# Altium project usbLora4RX.PrjPCB
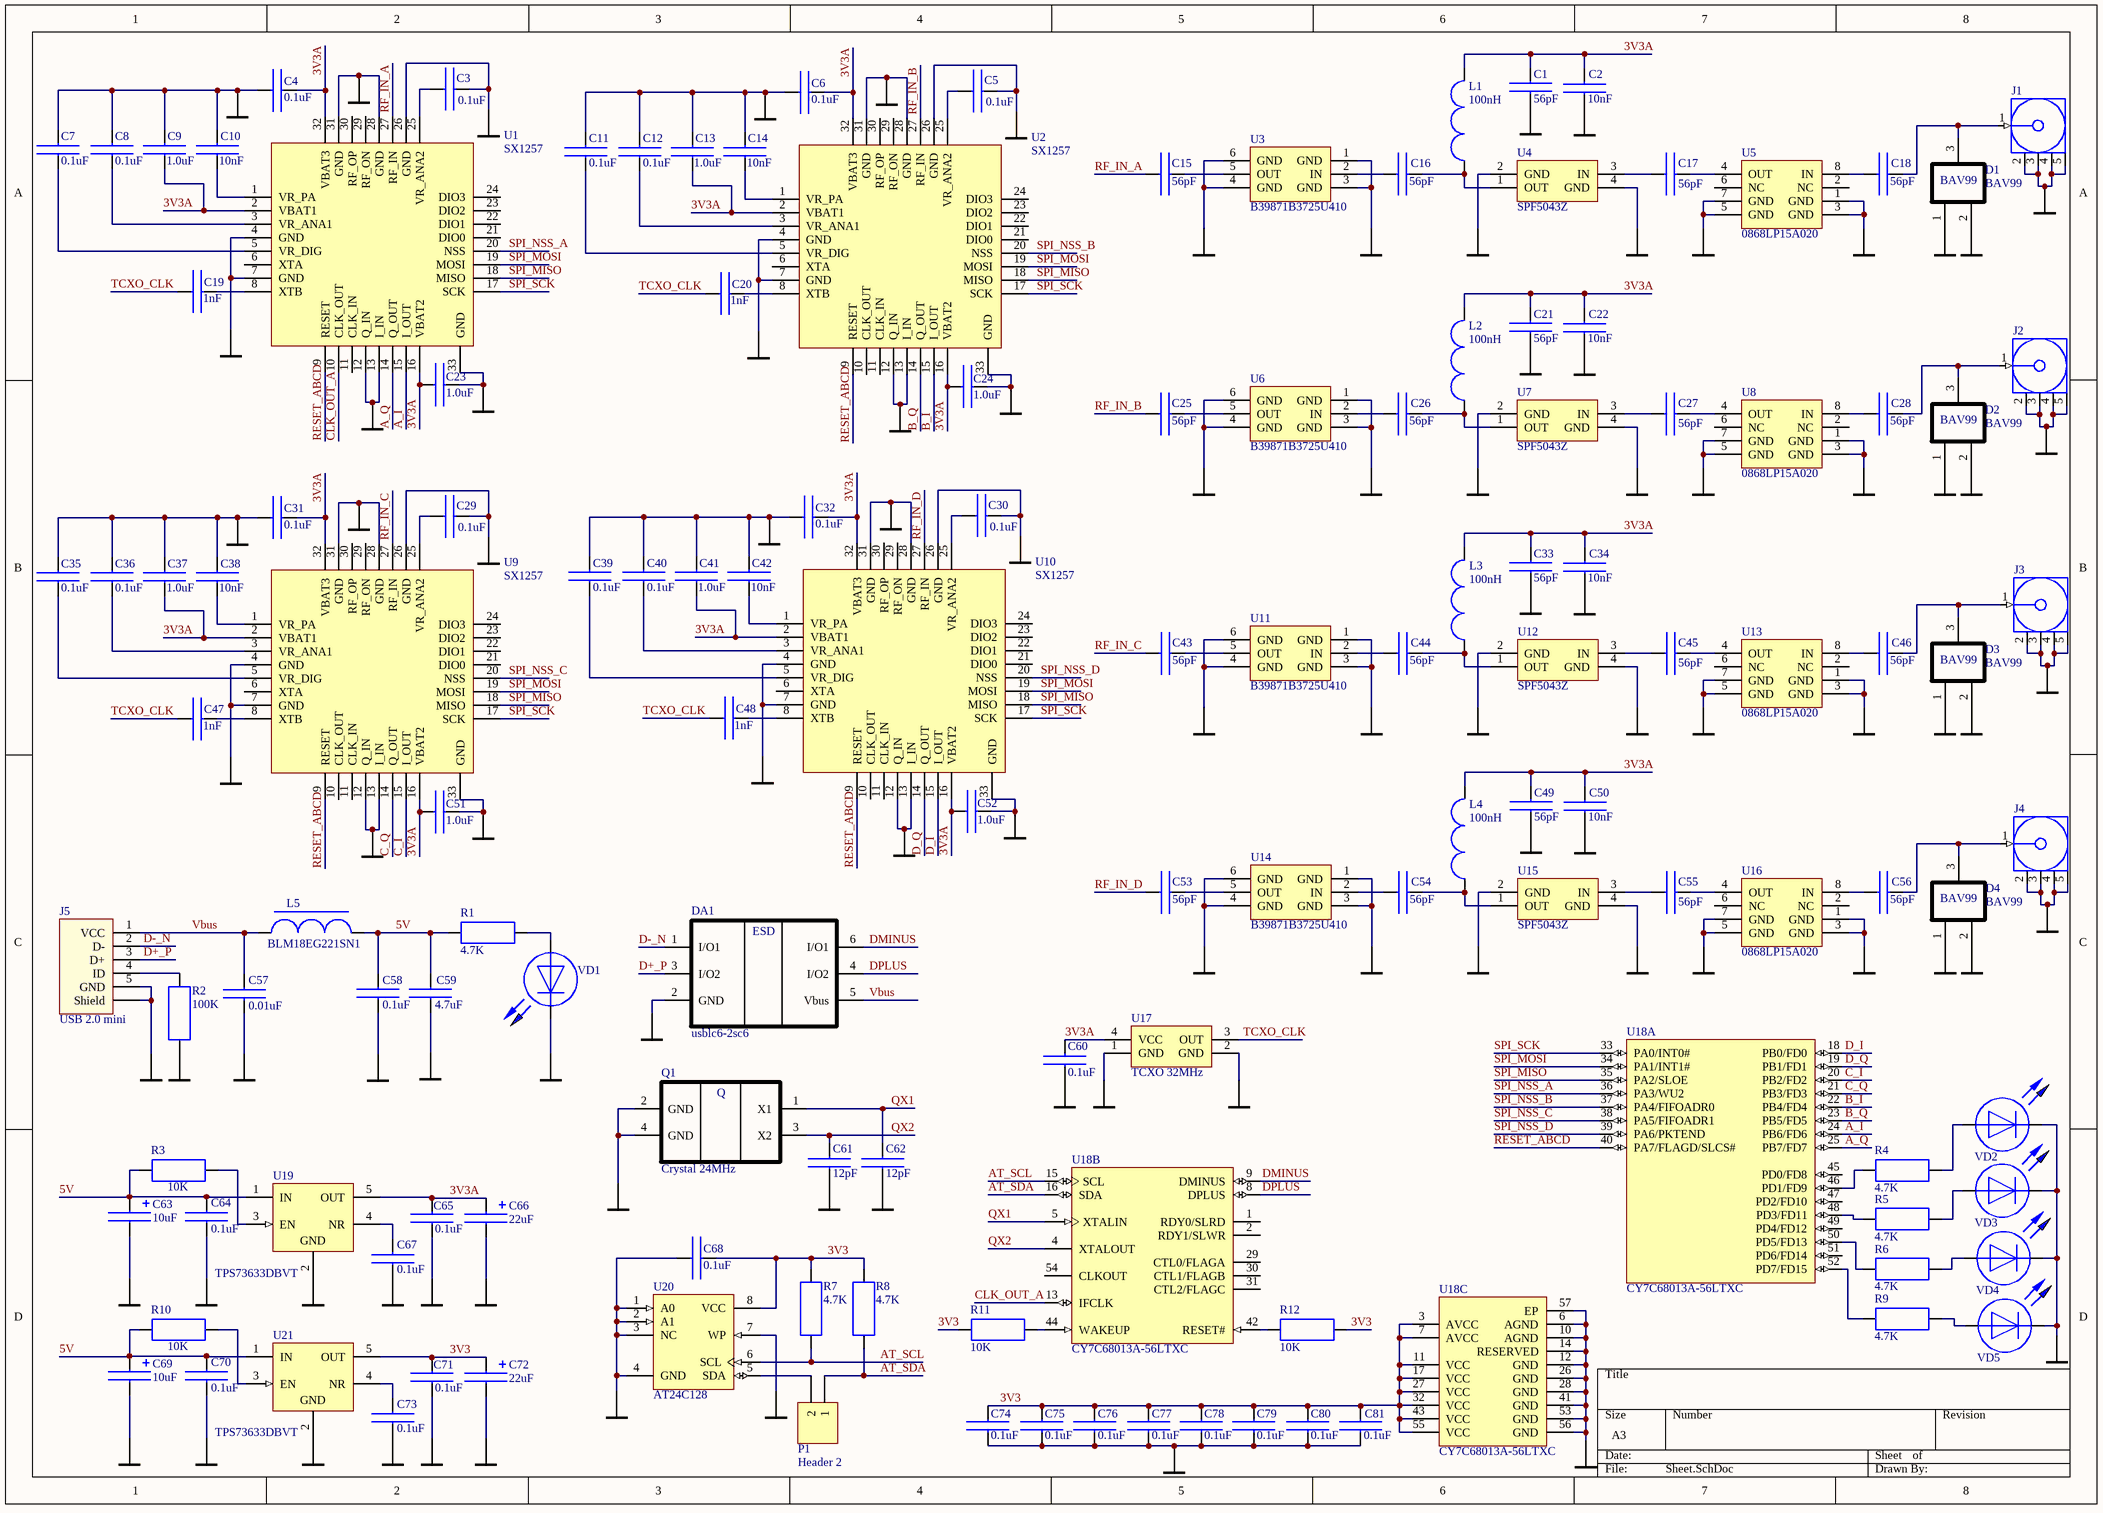
[diagram p0: Sheet.SchDoc]
1 sheet, 136 parts. Net scope: global (net labels, ports and power ports of the same name join across sheets).
Board file: PCB1.PcbDoc

## Sheet Sheet.SchDoc
size A3

### Parts
C1  56pF  [CAP(0603)]
C2  10nF  [CAP(0603)]
C3  0.1uF  [CAP(0603)]
C4  0.1uF  [CAP(0603)]
C5  0.1uF  [CAP(0603)]
C6  0.1uF  [CAP(0603)]
C7  0.1uF  [CAP(0603)]
C8  0.1uF  [CAP(0603)]
C9  1.0uF  [CAP(0603)]
C10  10nF  [CAP(0603)]
C11  0.1uF  [CAP(0603)]
C12  0.1uF  [CAP(0603)]
C13  1.0uF  [CAP(0603)]
C14  10nF  [CAP(0603)]
C15  56pF  [CAP(0603)]
C16  56pF  [CAP(0603)]
C17  56pF  [CAP(0603)]
C18  56pF  [CAP(0603)]
C19  1nF  [CAP(0603)]
C20  1nF  [CAP(0603)]
C21  56pF  [CAP(0603)]
C22  10nF  [CAP(0603)]
C23  1.0uF  [CAP(0603)]
C24  1.0uF  [CAP(0603)]
C25  56pF  [CAP(0603)]
C26  56pF  [CAP(0603)]
C27  56pF  [CAP(0603)]
C28  56pF  [CAP(0603)]
C29  0.1uF  [CAP(0603)]
C30  0.1uF  [CAP(0603)]
C31  0.1uF  [CAP(0603)]
C32  0.1uF  [CAP(0603)]
C33  56pF  [CAP(0603)]
C34  10nF  [CAP(0603)]
C35  0.1uF  [CAP(0603)]
C36  0.1uF  [CAP(0603)]
C37  1.0uF  [CAP(0603)]
C38  10nF  [CAP(0603)]
C39  0.1uF  [CAP(0603)]
C40  0.1uF  [CAP(0603)]
C41  1.0uF  [CAP(0603)]
C42  10nF  [CAP(0603)]
C43  56pF  [CAP(0603)]
C44  56pF  [CAP(0603)]
C45  56pF  [CAP(0603)]
C46  56pF  [CAP(0603)]
C47  1nF  [CAP(0603)]
C48  1nF  [CAP(0603)]
C49  56pF  [CAP(0603)]
C50  10nF  [CAP(0603)]
C51  1.0uF  [CAP(0603)]
C52  1.0uF  [CAP(0603)]
C53  56pF  [CAP(0603)]
C54  56pF  [CAP(0603)]
C55  56pF  [CAP(0603)]
C56  56pF  [CAP(0603)]
C57  0.01uF  [CAP(0603)]
C58  0.1uF  [CAP(0603)]
C59  4.7uF  [CAP(0603)]
C60  0.1uF  [CAP(0603)]
C61  12pF  [CAP(0603)]
C62  12pF  [CAP(0603)]
C63  10uF  [CC3216(1206)x18]
C64  0.1uF  [CAP(0603)]
C65  0.1uF  [CAP(0603)]
C66  22uF  [CC3216(1206)x18]
C67  0.1uF  [CAP(0603)]
C68  0.1uF  [CAP(0603)]
C69  10uF  [CC3216(1206)x18]
C70  0.1uF  [CAP(0603)]
C71  0.1uF  [CAP(0603)]
C72  22uF  [CC3216(1206)x18]
C73  0.1uF  [CAP(0603)]
C74  0.1uF  [CAP(0603)]
C75  0.1uF  [CAP(0603)]
C76  0.1uF  [CAP(0603)]
C77  0.1uF  [CAP(0603)]
C78  0.1uF  [CAP(0603)]
C79  0.1uF  [CAP(0603)]
C80  0.1uF  [CAP(0603)]
C81  0.1uF  [CAP(0603)]
D1  BAV99  [SOT-23B]
D2  BAV99  [SOT-23B]
D3  BAV99  [SOT-23B]
D4  BAV99  [SOT-23B]
DA1  usblc6-2sc6  [SOT23-6L]
J1  60312202114514  [60312202114514]  (value not drawn)
J2  60312202114514  [60312202114514]  (value not drawn)
J3  60312202114514  [60312202114514]  (value not drawn)
J4  60312202114514  [60312202114514]  (value not drawn)
J5  USB 2.0 mini  [65100516121]
L1  100nH  [L_0603]
L2  100nH  [L_0603]
L3  100nH  [L_0603]
L4  100nH  [L_0603]
L5  BLM18EG221SN1  [BLM18EG221SN1]
P1  Header 2  [HDR1X2]
Q1  Crystal 24MHz  [SMD3225]
R1  4.7K  [RES(0603)]
R2  100K  [RES(0603)]
R3  10K  [RES(0603)]
R4  4.7K  [RES(0603)]
R5  4.7K  [RES(0603)]
R6  4.7K  [RES(0603)]
R7  4.7K  [RES(0603)]
R8  4.7K  [RES(0603)]
R9  4.7K  [RES(0603)]
R10  10K  [RES(0603)]
R11  10K  [RES(0603)]
R12  10K  [RES(0603)]
U1  SX1257  [QFN-32]
U2  SX1257  [QFN-32]
U3  B39871B3725U410  [SAW_Filter]
U4  SPF5043Z  [SOT343-4]
U5  0868LP15A020  [LPF868]
U6  B39871B3725U410  [SAW_Filter]
U7  SPF5043Z  [SOT343-4]
U8  0868LP15A020  [LPF868]
U9  SX1257  [QFN-32]
U10  SX1257  [QFN-32]
U11  B39871B3725U410  [SAW_Filter]
U12  SPF5043Z  [SOT343-4]
U13  0868LP15A020  [LPF868]
U14  B39871B3725U410  [SAW_Filter]
U15  SPF5043Z  [SOT343-4]
U16  0868LP15A020  [LPF868]
U17  TCXO 32MHz  [TCXO]
U18  CY7C68013A-56LTXC  [CYP-LTX56-5200X4500TP_N]  (parts A,B,C of 3)
U19  TPS73633DBVT  [TI-DBV5_N]
U20  AT24C128  [8S1_N]
U21  TPS73633DBVT  [TI-DBV5_N]
VD1  VD_6  [LED_0603]  (value not drawn)
VD2  VD_6  [LED_0603]  (value not drawn)
VD3  VD_6  [LED_0603]  (value not drawn)
VD4  VD_6  [LED_0603]  (value not drawn)
VD5  VD_6  [LED_0603]  (value not drawn)

### Nets
GND: C1.1 C2.1 C3.2 C4.1 C5.2 C6.1 C7.2 C8.2 C9.2 C10.2 C11.2 C12.2 C13.2 C14.2 C21.1 C22.1 C23.1 C24.1 C29.2 C30.2 C31.1 C32.1 C33.1 C34.1 C35.2 C36.2 C37.2 C38.2 C39.2 C40.2 C41.2 C42.2 C49.1 C50.1 C51.1 C52.1 C57.1 C58.1 C59.1 C60.1 C61.1 C62.1 C63.2 C64.1 C65.1 C66.2 C67.1 C68.1 C69.2 C70.1 C71.1 C72.2 C73.1 C74.1 C75.1 C76.1 C77.1 C78.1 C79.1 C80.1 C81.1 D1.1 D1.2 D2.1 D2.2 D3.1 D3.2 D4.1 D4.2 DA1.2(GND) J1.2(GND) J1.3(GND) J1.4(GND) J1.5(GND) J2.2(GND) J2.3(GND) J2.4(GND) J2.5(GND) J3.2(GND) J3.3(GND) J3.4(GND) J3.5(GND) J4.2(GND) J4.3(GND) J4.4(GND) J4.5(GND) J5.5(GND) J5.Shell(Shield) Q1.2(GND) Q1.4(GND) R2.1 U1.4(GND) U1.7(GND) U1.12(Q_IN) U1.13(I_IN) U1.26(GND) U1.28(GND) U1.31(GND) U1.33(GND) U2.4(GND) U2.7(GND) U2.12(Q_IN) U2.13(I_IN) U2.26(GND) U2.28(GND) U2.31(GND) U2.33(GND) U3.1(GND) U3.3(GND) U3.4(GND) U3.6(GND) U4.2(GND) U4.4(GND) U5.1(GND) U5.3(GND) U5.5(GND) U5.7(GND) U6.1(GND) U6.3(GND) U6.4(GND) U6.6(GND) U7.2(GND) U7.4(GND) U8.1(GND) U8.3(GND) U8.5(GND) U8.7(GND) U9.4(GND) U9.7(GND) U9.12(Q_IN) U9.13(I_IN) U9.26(GND) U9.28(GND) U9.31(GND) U9.33(GND) U10.4(GND) U10.7(GND) U10.12(Q_IN) U10.13(I_IN) U10.26(GND) U10.28(GND) U10.31(GND) U10.33(GND) U11.1(GND) U11.3(GND) U11.4(GND) U11.6(GND) U12.2(GND) U12.4(GND) U13.1(GND) U13.3(GND) U13.5(GND) U13.7(GND) U14.1(GND) U14.3(GND) U14.4(GND) U14.6(GND) U15.2(GND) U15.4(GND) U16.1(GND) U16.3(GND) U16.5(GND) U16.7(GND) U17.1(GND) U17.2(GND) U18.6(AGND) U18.10(AGND) U18.12(GND) U18.14(RESERVED) U18.26(GND) U18.28(GND) U18.41(GND) U18.53(GND) U18.56(GND) U18.57(EP) U19.2(GND) U20.1(A0) U20.2(A1) U20.3(NC) U20.4(GND) U20.7(WP) U21.2(GND) VD1.K VD2.K VD3.K VD4.K VD5.K
3V3: C68.2 C71.2 C72.1 C74.2 C75.2 C76.2 C77.2 C78.2 C79.2 C80.2 C81.2 R7.2 R8.2 R11.1 R12.2 U18.3(AVCC) U18.7(AVCC) U18.11(VCC) U18.17(VCC) U18.27(VCC) U18.32(VCC) U18.43(VCC) U18.55(VCC) U20.8(VCC) U21.5(OUT)
3V3A: C1.2 C2.2 C4.2 C6.2 C9.1 C13.1 C21.2 C22.2 C23.2 C24.2 C31.2 C32.2 C33.2 C34.2 C37.1 C41.1 C49.2 C50.2 C51.2 C52.2 C60.2 C65.2 C66.1 L1.2 L2.2 L3.2 L4.2 U1.2(VBAT1) U1.16(VBAT2) U1.32(VBAT3) U2.2(VBAT1) U2.16(VBAT2) U2.32(VBAT3) U9.2(VBAT1) U9.16(VBAT2) U9.32(VBAT3) U10.2(VBAT1) U10.16(VBAT2) U10.32(VBAT3) U17.4(VCC) U19.5(OUT)
5V: C58.2 C59.2 C63.1 C64.2 C69.1 C70.2 L5.2 R1.1 R3.1 R10.1 U19.1(IN) U21.1(IN)
A_I: U1.15(I_OUT) U18.24(PB6/FD6)
A_Q: U1.14(Q_OUT) U18.25(PB7/FD7)
AT_SCL: R7.1 U18.15(SCL) U20.6(SCL)
AT_SDA: P1.1 R8.1 U18.16(SDA)
B_I: U2.15(I_OUT) U18.22(PB4/FD4)
B_Q: U2.14(Q_OUT) U18.23(PB5/FD5)
C_I: U9.15(I_OUT) U18.20(PB2/FD2)
C_Q: U9.14(Q_OUT) U18.21(PB3/FD3)
CLK_OUT_A: U1.10(CLK_OUT) U18.13(IFCLK)
D+_P: DA1.3(I/O2) J5.3(D+)
D-_N: DA1.1(I/O1) J5.2(D-)
D_I: U10.15(I_OUT) U18.18(PB0/FD0)
D_Q: U10.14(Q_OUT) U18.19(PB1/FD1)
DMINUS: DA1.6(I/O1) U18.9(DMINUS)
DPLUS: DA1.4(I/O2) U18.8(DPLUS)
QX1: C62.2 Q1.1(X1) U18.5(XTALIN)
QX2: C61.2 Q1.3(X2) U18.4(XTALOUT)
RESET_ABCD: U1.9(RESET) U2.9(RESET) U9.9(RESET) U10.9(RESET) U18.40(PA7/FLAGD/SLCS#)
RF_IN_A: C15.1 U1.27(RF_IN)
RF_IN_B: C25.1 U2.27(RF_IN)
RF_IN_C: C43.1 U9.27(RF_IN)
RF_IN_D: C53.1 U10.27(RF_IN)
SPI_MISO: U1.18(MISO) U2.18(MISO) U9.18(MISO) U10.18(MISO) U18.35(PA2/SLOE)
SPI_MOSI: U1.19(MOSI) U2.19(MOSI) U9.19(MOSI) U10.19(MOSI) U18.34(PA1/INT1#)
SPI_NSS_A: U1.20(NSS) U18.36(PA3/WU2)
SPI_NSS_B: U2.20(NSS) U18.37(PA4/FIFOADR0)
SPI_NSS_C: U9.20(NSS) U18.38(PA5/FIFOADR1)
SPI_NSS_D: U10.20(NSS) U18.39(PA6/PKTEND)
SPI_SCK: U1.17(SCK) U2.17(SCK) U9.17(SCK) U10.17(SCK) U18.33(PA0/INT0#)
TCXO_CLK: C19.1 C20.1 C47.1 C48.1 U17.3(OUT)
Vbus: C57.2 DA1.5(Vbus) J5.1(VCC) L5.1
NetC3_1: C3.1 U1.25(VR_ANA2)
NetC5_1: C5.1 U2.25(VR_ANA2)
NetC7_1: C7.1 U1.5(VR_DIG)
NetC8_1: C8.1 U1.3(VR_ANA1)
NetC10_1: C10.1 U1.1(VR_PA)
NetC11_1: C11.1 U2.5(VR_DIG)
NetC12_1: C12.1 U2.3(VR_ANA1)
NetC14_1: C14.1 U2.1(VR_PA)
NetC15_2: C15.2 U3.5(OUT)
NetC16_1: C16.1 U3.2(IN)
NetC16_2: C16.2 L1.1 U4.1(OUT)
NetC17_1: C17.1 U4.3(IN)
NetC17_2: C17.2 U5.4(OUT)
NetC18_1: C18.1 U5.8(IN)
NetC18_2: C18.2 D1.3 J1.1(Signal)
NetC19_2: C19.2 U1.8(XTB)
NetC20_2: C20.2 U2.8(XTB)
NetC25_2: C25.2 U6.5(OUT)
NetC26_1: C26.1 U6.2(IN)
NetC26_2: C26.2 L2.1 U7.1(OUT)
NetC27_1: C27.1 U7.3(IN)
NetC27_2: C27.2 U8.4(OUT)
NetC28_1: C28.1 U8.8(IN)
NetC28_2: C28.2 D2.3 J2.1(Signal)
NetC29_1: C29.1 U9.25(VR_ANA2)
NetC30_1: C30.1 U10.25(VR_ANA2)
NetC35_1: C35.1 U9.5(VR_DIG)
NetC36_1: C36.1 U9.3(VR_ANA1)
NetC38_1: C38.1 U9.1(VR_PA)
NetC39_1: C39.1 U10.5(VR_DIG)
NetC40_1: C40.1 U10.3(VR_ANA1)
NetC42_1: C42.1 U10.1(VR_PA)
NetC43_2: C43.2 U11.5(OUT)
NetC44_1: C44.1 U11.2(IN)
NetC44_2: C44.2 L3.1 U12.1(OUT)
NetC45_1: C45.1 U12.3(IN)
NetC45_2: C45.2 U13.4(OUT)
NetC46_1: C46.1 U13.8(IN)
NetC46_2: C46.2 D3.3 J3.1(Signal)
NetC47_2: C47.2 U9.8(XTB)
NetC48_2: C48.2 U10.8(XTB)
NetC53_2: C53.2 U14.5(OUT)
NetC54_1: C54.1 U14.2(IN)
NetC54_2: C54.2 L4.1 U15.1(OUT)
NetC55_1: C55.1 U15.3(IN)
NetC55_2: C55.2 U16.4(OUT)
NetC56_1: C56.1 U16.8(IN)
NetC56_2: C56.2 D4.3 J4.1(Signal)
NetC67_2: C67.2 U19.4(NR)
NetC73_2: C73.2 U21.4(NR)
NetJ5_4: J5.4(ID) R2.2
NetP1_2: P1.2 U20.5(SDA)
NetR1_2: R1.2 VD1.A
NetR3_2: R3.2 U19.3(EN)
NetR4_1: R4.1 U18.46(PD1/FD9)
NetR4_2: R4.2 VD2.A
NetR5_1: R5.1 U18.48(PD3/FD11)
NetR5_2: R5.2 VD3.A
NetR6_1: R6.1 U18.50(PD5/FD13)
NetR6_2: R6.2 VD4.A
NetR9_1: R9.1 U18.52(PD7/FD15)
NetR9_2: R9.2 VD5.A
NetR10_2: R10.2 U21.3(EN)
NetR11_2: R11.2 U18.44(WAKEUP)
NetR12_1: R12.1 U18.42(RESET#)

Not connected (* = marked no-connect by the designer): U1 6(XTA) 11(CLK_IN) 21(DIO0) 22(DIO1) 23(DIO2) 24(DIO3) 29(RF_ON) 30(RF_OP); U2 6(XTA) 10(CLK_OUT) 11(CLK_IN) 21(DIO0) 22(DIO1) 23(DIO2) 24(DIO3) 29(RF_ON) 30(RF_OP); U5 2(NC) 6(NC); U8 2(NC) 6(NC); U9 6(XTA) 10(CLK_OUT) 11(CLK_IN) 21(DIO0) 22(DIO1) 23(DIO2) 24(DIO3) 29(RF_ON) 30(RF_OP); U10 6(XTA) 10(CLK_OUT) 11(CLK_IN) 21(DIO0) 22(DIO1) 23(DIO2) 24(DIO3) 29(RF_ON) 30(RF_OP); U13 2(NC) 6(NC); U16 2(NC) 6(NC); U18 1(RDY0/SLRD) 2(RDY1/SLWR) 29(CTL0/FLAGA) 30(CTL1/FLAGB) 31(CTL2/FLAGC) 45(PD0/FD8) 47(PD2/FD10) 49(PD4/FD12) 51(PD6/FD14) 54(CLKOUT)

### Notes on the sheet
- (in symbol Crystal 24MHz) Q
- (in symbol usblc6-2sc6) ESD

### Library data of the parts
C1-C62 C64 C65 C67 C68 C70 C71 C73-C81 = CAP
C63 C66 C69 C72 = Tantalum: Tantalum SMD capacitor
J1-J4 = 60312202114514: WR-SMA SMA PCB End Launch Jack Flat Tab for 1.6 mm PCB; Impedance: 50 Ohm; Frequency Range: DC~18 GHz; Orientation Type: Straight; ComponentLink1Description: Manufacturer; ComponentLink1URL: http://www.we-online.de; ComponentLink2Description: Datasheet; ComponentLink2URL: https://katalog.we-online.de/em/datasheet/60312202114514.pdf; Part Number: 60312202114514; Published Date: August 2018; Publisher: Wurth Elektronik; Operating Temperature: -65 to 165 degC; Gender: Jack; Packaging: Tray; Connector Type: SMA; Mounting Technology: SMT
J5 = USB 2.0 mini: Mini USB 2.0 Type B SMT Horizontal 5 Contacts WR-COM
L1-L4 = IND
L5 = BLM18EG221SN1: SMD Ferrite Bead 2A 220 Ohm(100MHz); Name: Чип-феррит BLM18EG221SN1; Type: Inductor; Vendor1: Murata Manufacturing, Co., Japan; Ta: -55+125; DC Resistance: 0.05 Ohm; Impedance: 220 Ohm (100MHz) / 260 Ohm (1GHz); Vendor1Name: BLM18EG221SN1; Current: 2 A
P1 = Header 2: Header, 2-Pin; LatestRevisionDate: 17-Jul-2002; LatestRevisionNote: Re-released for DXP Platform.; Publisher: Altium Limited
R1-R12 = RES: Chip Resistor
U3 U6 U11 U14 = B39871B3725U410: SAW Filter, 869MHz Center
U17 = TCXO
U18 = CY7C68013A-56LTXC: EZ-USB(R) FX2LP(TM) USB Microcontroller High-Speed USB Peripheral Controller, 16 KB, 24 I/Os, 3 to 3.6 V, 0 to 70 degC, 56-Pin QFN (LTX56), Tray
U19 U21 = TPS73633DBVT: Single Output Low Noise LDO, 400 mA, Fixed 3.3 V Output, 1.7 to 5.5 V Input, with Reverse Current Protection, 5-pin SOT-23 (DBV), -40 to 85 degC, Green (RoHS & no Sb/Br); Manufacturer: Texas Instruments; Accuracy(%): 1; Fixed Output Options(V): 3.3; Iout(Max)(A): 0.4; Iq(Typ)(mA): 0.3; Rating: Catalog; SubFamily: Single Channel LDO; Vdo(Typ)(mV): 75; Vin(Max)(V): 5.5; Vin(Min)(V): 1.7; DatasheetVersion: SBVS038T; PackageVersion: 4073253-4/K; PackageReference: DBV5; PackageDescription: 5-Pin Plastic Small Outline, Body 1.60 Г— 2.90 mm, Pitch 0.95 mm; Eco-Plan: Green (RoHS & no Sb/Br); Vout Adj(Max)(V): 3.3; Vout Adj(Min)(V): 3.3; Mounting Technology: Surface Mount; Code_JEDEC: MO-178; PartNumber: TPS73633DBVT